# Altium schematic sheet Power.SchDoc
size 431 x 279 mm; SheetNumber: 2; SheetTotal: 6
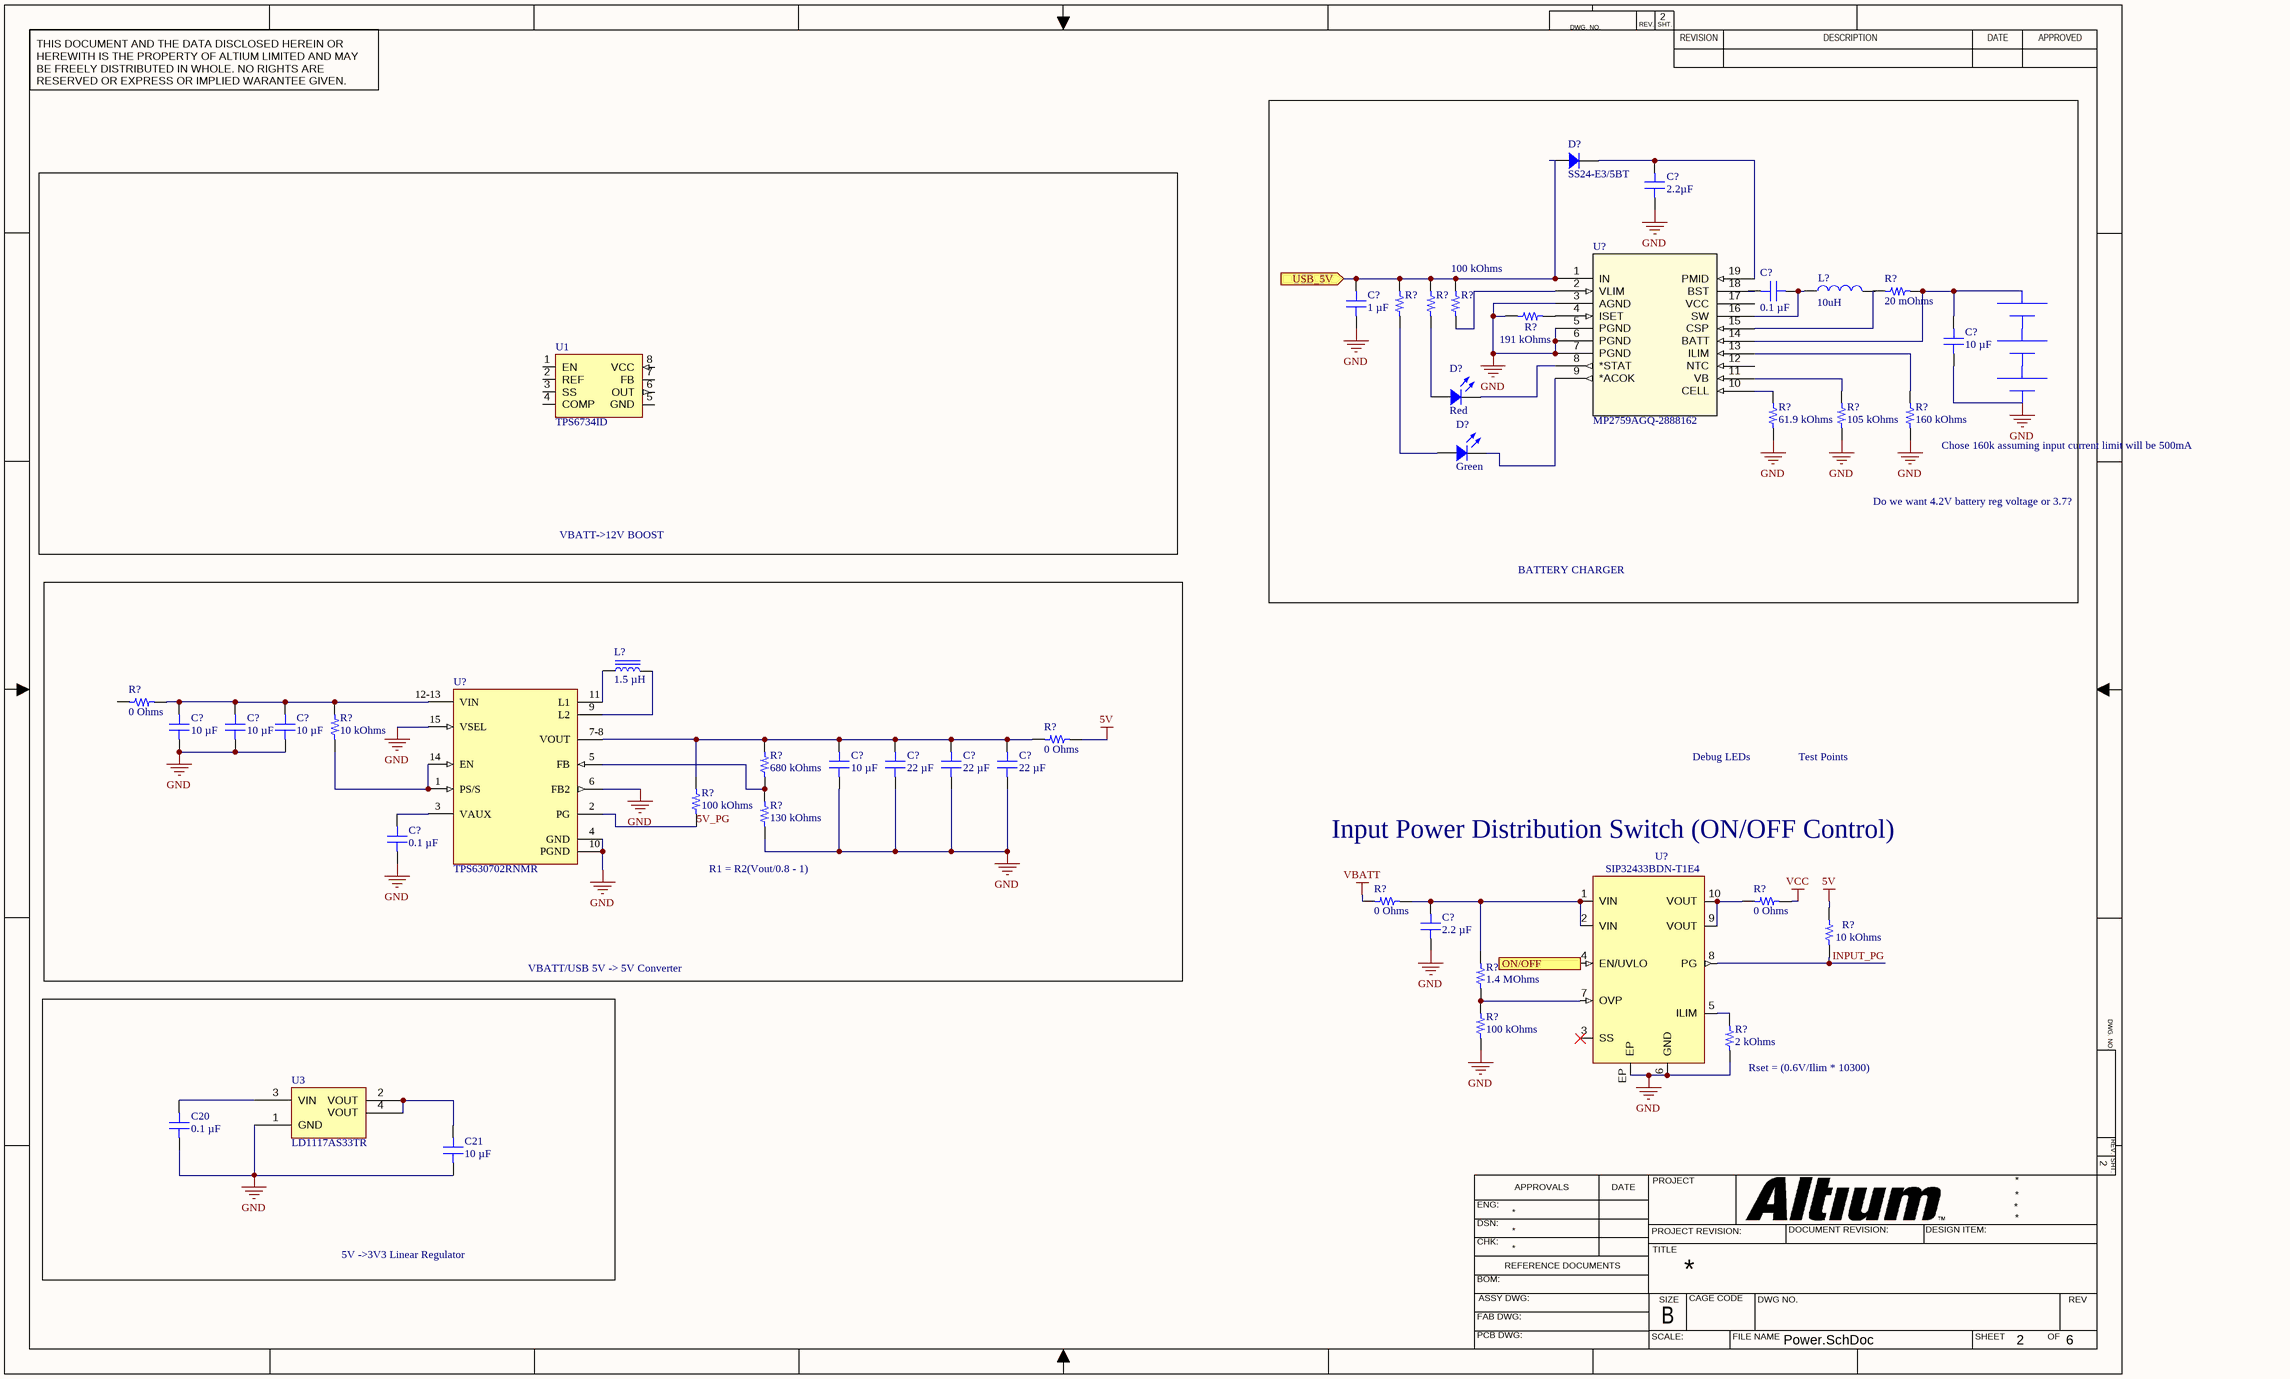
[diagram p0: Power.SchDoc]

## Parts
(Parts that share a designator on the sheet are numbered #1, #2 ... from top to bottom, then left to right.)
*#1  14500 Battery  (value not drawn)  (part A of 3)
*#2  14500 Battery  (value not drawn)  (part A of 3)
*#3  14500 Battery  (value not drawn)  (part A of 3)
C20  0.1 µF  [CAP 0603_1608]
C21  10 µF  [CAP 0603_1608]
C?#1  2.2µF  [CAP 1206_3216 - 1.8MM]
C?#2  0.1 µF  [CAP 0603_1608]
C?#3  1 µF  [CAP 0805_2012]
C?#4  10 µF  [CAP 1206_3216 - 0.8MM]
C?#5  10 µF  [CAP 0603_1608]
C?#6  10 µF  [CAP 0603_1608]
C?#7  10 µF  [CAP 0603_1608]
C?#8  10 µF  [CAP 0603_1608]
C?#9  22 µF  [CAP 0603_1608]
C?#10  22 µF  [CAP 0603_1608]
C?#11  22 µF  [CAP 0603_1608]
C?#12  0.1 µF  [CAP 0603_1608]
C?#13  2.2 µF  [CAP 0805_2012]
D?#1  SS24-E3/5BT  [DO214AA SMB]
D?#2  Red  [LED 1206_3216 RED]
D?#3  Green  [LED 0603_1608 GREEN]
L?#1  10uH  [INDM8366X28N]
L?#2  1.5 µH  [WURTH WE-LQS 6045]
R?#1  20 mOhms  [RES 0805_2012]
R?#2  150 Ohms  [RES 0603_1608]  (value not drawn)
R?#3  150 Ohms  [RES 0603_1608]  (value not drawn)
R?#4  100 kOhms  [RES 0603_1608]
R?#5  191 kOhms  [RES 0603_1608]
R?#6  61.9 kOhms  [RES 0603_1608]
R?#7  105 kOhms  [RES 0603_1608]
R?#8  160 kOhms  [RES 0603_1608]
R?#9  0 Ohms  [RES 0603_1608]
R?#10  10 kOhms  [RES 0603_1608]
R?#11  0 Ohms  [RES 0603_1608]
R?#12  680 kOhms  [RES 0603_1608]
R?#13  100 kOhms  [RES 0603_1608]
R?#14  130 kOhms  [RES 0603_1608]
R?#15  0 Ohms  [RES 0603_1608]
R?#16  0 Ohms  [RES 0603_1608]
R?#17  10 kOhms  [RES 0603_1608]
R?#18  1.4 MOhms  [RES 0603_1608]
R?#19  100 kOhms  [RES 0603_1608]
R?#20  2 kOhms  [RES 0603_1608]
U1  TPS6734ID  [TI SOIC-8 D]
U3  LD1117AS33TR  [ST SOT-223]
U?#1  MP2759AGQ-2888162  [MP2759AGQ-2888162-Footprint-1]
U?#2  TPS630702RNMR  [FP-RNM0015A-MFG]
U?#3  SIP32433BDN-T1E4  [SON50P300X100_HS-11N]

## Blocks framed on the sheet
VBATT->12V BOOST: U1
5V ->3V3 Linear Regulator: C20 C21 U3

## Ports
ON/OFF (in), USB_5V (in)

## Nets
5V: R?#11.2 R?#17.2
GND: C20.1 C21.1 C?#1.2 C?#3.1 C?#4.1 C?#5.1 C?#6.1 C?#7.1 C?#8.1 C?#9.1 C?#10.1 C?#11.1 C?#12.1 C?#13.1 R?#5.1 R?#6.1 R?#7.2 R?#8.1 R?#14.1 R?#19.1 R?#20.1 U3.1(GND) U?#1.3(AGND) U?#1.5(PGND) U?#1.6(PGND) U?#1.7(PGND) U?#2.4(GND) U?#2.6(FB2) U?#2.10(PGND) U?#2.15(VSEL) U?#3.6(GND) U?#3.EP
VBATT: R?#15.1
VCC: R?#16.2
5V_PG: R?#13.1 U?#2.2(PG)
INPUT_PG: R?#17.1 U?#3.8(PG)
ON/OFF: U?#3.4(EN/UVLO) ; port ON/OFF
USB_5V: C?#3.2 D?#1.1 R?#2.2 R?#3.2 R?#4.2 U?#1.1(IN) ; port USB_5V
NetC20_2: C20.2 U3.3(VIN)
NetC21_2: C21.2 U3.2(VOUT) U3.4(VOUT)
NetC?#1_1: C?#1.1 D?#1.2 U?#1.19(PMID)
NetC?#2_1: C?#2.1 U?#1.18(BST)
NetC?#2_2: C?#2.2 L?#1.1 U?#1.16(SW)
NetC?#4_2: C?#4.2 R?#1.2 U?#1.14(BATT)
NetC?#5_2: C?#5.2 C?#6.2 C?#7.2 R?#9.2 R?#10.2 U?#2.12-13(VIN)
NetC?#8_2: C?#8.2 C?#9.2 C?#10.2 C?#11.2 R?#11.1 R?#12.2 R?#13.2 U?#2.7-8(VOUT)
NetC?#12_2: C?#12.2 U?#2.3(VAUX)
NetC?#13_2: C?#13.2 R?#15.2 R?#18.2 U?#3.1(VIN) U?#3.2(VIN)
NetD?#2_1: D?#2.1 R?#3.1
NetD?#2_2: D?#2.2 U?#1.8(*STAT)
NetD?#3_1: D?#3.1 R?#2.1
NetD?#3_2: D?#3.2 U?#1.9(*ACOK)
NetL?#2_1: L?#2.1 U?#2.11(L1)
NetL?#2_2: L?#2.2 U?#2.9(L2)
NetR?#1_1: R?#1.1 U?#1.15(CSP)
NetR?#4_1: R?#4.1 U?#1.2(VLIM)
NetR?#5_2: R?#5.2 U?#1.4(ISET)
NetR?#6_2: R?#6.2 U?#1.10(CELL)
NetR?#7_1: R?#7.1 U?#1.11(VB)
NetR?#8_2: R?#8.2 U?#1.13(ILIM)
NetR?#10_1: R?#10.1 U?#2.1(PS/S) U?#2.14(EN)
NetR?#12_1: R?#12.1 R?#14.2 U?#2.5(FB)
NetR?#16_1: R?#16.1 U?#3.9(VOUT) U?#3.10(VOUT)
NetR?#18_1: R?#18.1 R?#19.2 U?#3.7(OVP)
NetR?#20_2: R?#20.2 U?#3.5(ILIM)

Not connected (* = marked no-connect by the designer): L?#1 2; R?#9 1; U1 1(EN) 2(REF) 3(SS) 4(COMP) 5(GND) 6(OUT) 7(FB) 8(VCC); U?#1 12(NTC) 17(VCC); U?#3 3(SS)*

## Notes on the sheet
- Chose 160k assuming input current limit will be 500mA
- Do we want 4.2V battery reg voltage or 3.7?
- BATTERY CHARGER
- Debug LEDs
- Test Points
- (near R?#14) R1 = R2(Vout/0.8 - 1)
- Input Power Distribution Switch (ON/OFF Control)
- VBATT/USB 5V -> 5V Converter
- (near R?#20) Rset = (0.6V/Ilim * 10300)
- DWG. NO.
- REV.
- SHT.
- THIS DOCUMENT AND THE DATA DISCLOSED HEREIN OR HEREWITH IS THE PROPERTY OF ALTIUM LIMITED AND MAY BE FREELY DISTRIBUTED IN WHOLE. NO RIGHTS ARE RESERVED OR EXPRESS OR IMPLIED WARANTEE GIVEN.
- REVISION
- DESCRIPTION
- DATE
- APPROVED
- ENG:
- APPROVALS
- PROJECT
- DSN:
- CHK:
- REFERENCE DOCUMENTS
- PROJECT REVISION:
- TITLE
- DOCUMENT REVISION:
- DESIGN ITEM:
- BOM:
- FAB DWG:
- PCB DWG:
- ASSY DWG:
- SCALE:
- SIZE
- B
- CAGE CODE
- FILE NAME
- DWG NO.
- SHEET
- OF
- REV

## Library data of the parts
*#1-*#3 = CMP-00063-1: YDL 14500 1000mAh 10A Battery
C20 C?#12 = C0603C104K5RAC7411: CAP CER 0.1UF 50V X7R 0603; manufacturer: KEMET; Tolerance: ±10%; Part Number: C0603C104K5RAC7411; Value: 0.1 µF; Applications: Bypass, Decoupling; Capacitance: 0.1 µF; componentlink1description: Datasheet; componentlink1url: https://api.kemet.com/component-edge/download/datasheet/C0603C104K5RAC7411.pdf; componentlink2description: DigiKey Link; componentlink2url: https://www.digikey.com/en/products/detail/kemet/C0603C104K5RAC7411/3317013; Device Package: 0603 (1608 Metric); Lifecycle Status: Active; Mounting Type: Surface Mount, MLCC; Operating Temperature: -55°C ~ 125°C; Package / Case: 0603 (1608 Metric); packaging: TapeAndReel; partid: 2233; Part Status: Active; price: 0.01; series: SMD Comm X7R; Size / Dimension: 0.063" L x 0.031" W (1.60mm x 0.80mm); Supplier 1: DigiKey; Temperature Coefficient: X7R; Thickness (Max): 0.035" (0.90mm); Voltage - Rated: 50V
  C20: lastupdated: 2022-03-07 3:18:24 PM; Minimum Order: 15000; Supplier Part Number 1: 399-7374-2-ND
  C?#12: lastupdated: 2023-01-26 8:08:16 PM; Minimum Order: 1; Supplier Part Number 1: 399-C0603C104K5RAC7411CT-ND
C21 = GRT188R61C106ME13D: CAP CER 10UF 16V X5R 0603; manufacturer: Murata Electronics; Tolerance: ±20%; Part Number: GRT188R61C106ME13D; Value: 10 µF; Applications: Automotive; Capacitance: 10 µF; componentlink1description: Datasheet; componentlink1url: https://search.murata.co.jp/Ceramy/image/img/A01X/G101/ENG/GRT188R61C106ME13-01.pdf; componentlink2description: DigiKey Link; componentlink2url: https://www.digikey.com/en/products/detail/murata-electronics/GRT188R61C106ME13D/5416740; Device Package: 0603 (1608 Metric); lastupdated: 2022-03-07 3:18:24 PM; Lifecycle Status: Active; Minimum Order: 1; Mounting Type: Surface Mount, MLCC; Operating Temperature: -55°C ~ 85°C; Package / Case: 0603 (1608 Metric); packaging: TapeAndReel; partid: 2515; Part Status: Active; price: 0.07; Ratings: AEC-Q200; series: GRT; Size / Dimension: 0.063" L x 0.031" W (1.60mm x 0.80mm); Supplier 1: DigiKey; Supplier Part Number 1: 490-12318-1-ND; Temperature Coefficient: X5R; Thickness (Max): 0.035" (0.90mm); Voltage - Rated: 16V
C?#1 = 12065C225K4Z2A: CAP CER 2.2UF 50V X7R 1206; manufacturer: AVX Corporation; Tolerance: ±10%; Part Number: 12065C225K4Z2A; Value: 2.2µF; Applications: Automotive, Boardflex Sensitive; Capacitance: 2.2µF; componentlink1description: Datasheet; componentlink1url: http://datasheets.avx.com/FlexitermMLCC.pdf; componentlink2description: DigiKey Link; componentlink2url: http://digikey.com/product-detail/en/avx-corporation/12065C225K4Z2A/478-9559-1-ND/5322897; Device Package: 1206 (3216 Metric); Features: Soft Termination; lastupdated: 2020-09-02 1:05:40 AM; Lifecycle Status: Active; Minimum Order: 1; Mounting Type: Surface Mount, MLCC; Operating Temperature: -55°C ~ 125°C; Package / Case: 1206 (3216 Metric); packaging: TapeAndReel; partid: 20142; Part Status: Active; price: 0.12; Ratings: AEC-Q200; series: FLEXITERM®; Size / Dimension: 0.126" L x 0.063" W (3.20mm x 1.60mm); Supplier 1: DigiKey; Supplier Part Number 1: 478-9559-1-ND; Temperature Coefficient: X7R; Thickness (Max): 0.070" (1.78mm); Voltage - Rated: 50V
C?#2 = CS0603KRX7R7BB104: CAP CER 0.1UF 16V X7R 0603; manufacturer: Yageo; Tolerance: ±10%; Part Number: CS0603KRX7R7BB104; Value: 0.1 µF; Applications: Boardflex Sensitive; Capacitance: 0.1 µF; componentlink1description: Datasheet; componentlink1url: http://www.yageo.com/NewPortal/yageodocoutput?fileName=/pdf/MLCC/UPY-ST_NPOX7R_16V-to-3KV_5.pdf; componentlink2description: DigiKey Link; componentlink2url: https://www.digikey.com/en/products/detail/yageo/CS0603KRX7R7BB104/6097897; Device Package: 0603 (1608 Metric); Features: Soft Termination; lastupdated: 2023-01-29 8:08:26 PM; Lifecycle Status: Active; Minimum Order: 1; Mounting Type: Surface Mount, MLCC; Operating Temperature: -55°C ~ 125°C; Package / Case: 0603 (1608 Metric); packaging: TapeAndReel; partid: 2286; Part Status: Active; price: 0.01; series: CS; Size / Dimension: 0.063" L x 0.031" W (1.60mm x 0.80mm); Supplier 1: DigiKey; Supplier Part Number 1: 311-3560-1-ND; Temperature Coefficient: X7R; Thickness (Max): 0.037" (0.95mm); Voltage - Rated: 16V
C?#3 = GCJ21BR71H105KA01L: CAP CER 1UF 50V X7R 0805; manufacturer: Murata Electronics; Tolerance: ±10%; Part Number: GCJ21BR71H105KA01L; Value: 1 µF; Applications: Automotive, Boardflex Sensitive; Capacitance: 1 µF; componentlink1description: Datasheet; componentlink1url: https://www.murata.com/~/media/webrenewal/support/library/catalog/products/capacitor/mlcc/c03e.ashx?la=en-us; componentlink2description: DigiKey Link; componentlink2url: https://www.digikey.com/en/products/detail/murata-electronics/GCJ21BR71H105KA01L/4903512; Device Package: 0805 (2012 Metric); Features: Soft Termination; lastupdated: 2023-01-26 8:11:38 PM; Lifecycle Status: Active; Minimum Order: 1; Mounting Type: Surface Mount, MLCC; Operating Temperature: -55°C ~ 125°C; Package / Case: 0805 (2012 Metric); packaging: TapeAndReel; partid: 2709; Part Status: Active; price: 0.05; Ratings: AEC-Q200; series: GCJ; Size / Dimension: 0.079" L x 0.049" W (2.00mm x 1.25mm); Supplier 1: DigiKey; Supplier Part Number 1: 490-10667-1-ND; Temperature Coefficient: X7R; Thickness (Max): 0.057" (1.45mm); Voltage - Rated: 50V
C?#4 = CL31B106KBHNNNE: CAP CER 10UF 50V X7R 1206; manufacturer: Samsung Electro-Mechanics; Tolerance: ±10%; Part Number: CL31B106KBHNNNE; Value: 10 µF; Applications: General Purpose; Capacitance: 10 µF; componentlink1description: Datasheet; componentlink1url: http://www.samsungsem.com/kr/support/product-search/mlcc/CL31B106KBHNNNE.jsp; componentlink2description: DigiKey Link; componentlink2url: https://www.digikey.com/en/products/detail/samsung-electro-mechanics/CL31B106KBHNNNE/5961251; Device Package: 1206 (3216 Metric); lastupdated: 2023-01-31 8:13:35 PM; Lifecycle Status: Active; Minimum Order: 1; Mounting Type: Surface Mount, MLCC; Operating Temperature: -55°C ~ 125°C; Package / Case: 1206 (3216 Metric); packaging: TapeAndReel; partid: 40563; Part Status: Active; price: 0.06; series: CL; Size / Dimension: 0.126" L x 0.063" W (3.20mm x 1.60mm); Supplier 1: DigiKey; Supplier Part Number 1: 1276-6767-1-ND; Temperature Coefficient: X7R; Thickness (Max): 0.071" (1.80mm); Voltage - Rated: 50V
C?#5-C?#8 = GRM188R61E106MA73J: CAP CER 10UF 25V X5R 0603; manufacturer: Murata Electronics; Tolerance: ±20%; Part Number: GRM188R61E106MA73J; Value: 10 µF; Applications: General Purpose; Capacitance: 10 µF; componentlink1description: Datasheet; componentlink1url: https://search.murata.co.jp/Ceramy/image/img/A01X/G101/ENG/GRM188R61E106MA73-01.pdf; componentlink2description: DigiKey Link; componentlink2url: https://www.digikey.com/en/products/detail/murata-electronics/GRM188R61E106MA73J/4905347; Device Package: 0603 (1608 Metric); lastupdated: 2023-01-26 8:07:52 PM; Lifecycle Status: Active; Minimum Order: 1; Mounting Type: Surface Mount, MLCC; Operating Temperature: -55°C ~ 85°C; Package / Case: 0603 (1608 Metric); packaging: TapeAndReel; partid: 10710; Part Status: Active; price: 0.04; series: GRM; Size / Dimension: 0.063" L x 0.031" W (1.60mm x 0.80mm); Supplier 1: DigiKey; Supplier Part Number 1: 490-12737-1-ND; Temperature Coefficient: X5R; Thickness (Max): 0.039" (1.00mm); Voltage - Rated: 25V
C?#9-C?#11 = CL10A226MPCNUBE: CAP CER 22UF 10V X5R 0603; manufacturer: Samsung Electro-Mechanics; Tolerance: ±20%; Part Number: CL10A226MPCNUBE; Value: 22 µF; Applications: Acoustic Noise Reduction; Capacitance: 22 µF; componentlink1description: Datasheet; componentlink1url: http://www.samsungsem.com/kr/support/product-search/mlcc/CL10A226MPCNUBE.jsp; componentlink2description: DigiKey Link; componentlink2url: https://www.digikey.com/en/products/detail/samsung-electro-mechanics/CL10A226MPCNUBE/5960988; Device Package: 0603 (1608 Metric); lastupdated: 2023-01-26 8:08:11 PM; Lifecycle Status: Active; Minimum Order: 1; Mounting Type: Surface Mount, MLCC; Operating Temperature: -55°C ~ 85°C; Package / Case: 0603 (1608 Metric); packaging: TapeAndReel; partid: 3985; Part Status: Active; price: 0.05; series: CL; Size / Dimension: 0.063" L x 0.031" W (1.60mm x 0.80mm); Supplier 1: DigiKey; Supplier Part Number 1: 1276-6504-1-ND; Temperature Coefficient: X5R; Thickness (Max): 0.037" (0.95mm); Voltage - Rated: 10V
C?#13 = C2012X7R1V225K125AB: CAP CER 2.2UF 35V X7R 0805; manufacturer: TDK Corporation; Tolerance: ±10%; Part Number: C2012X7R1V225K125AB; Value: 2.2 µF; Applications: General Purpose; Capacitance: 2.2 µF; componentlink1description: Datasheet; componentlink1url: https://product.tdk.com/info/en/catalog/datasheets/mlcc_commercial_general_en.pdf?ref_disty=digikey; componentlink2description: DigiKey Link; componentlink2url: https://www.digikey.com/en/products/detail/tdk-corporation/C2012X7R1V225K125AB/2732986; Device Package: 0805 (2012 Metric); Features: Low ESL; lastupdated: 2023-01-03 8:10:54 PM; Lifecycle Status: Active; Minimum Order: 1; Mounting Type: Surface Mount, MLCC; Operating Temperature: -55°C ~ 125°C; Package / Case: 0805 (2012 Metric); packaging: TapeAndReel; partid: 3412; Part Status: Active; price: 0.12; series: C; Size / Dimension: 0.079" L x 0.049" W (2.00mm x 1.25mm); Supplier 1: DigiKey; Supplier Part Number 1: 445-7551-1-ND; Temperature Coefficient: X7R; Thickness (Max): 0.057" (1.45mm); Voltage - Rated: 35V
D?#1 = SS24-E3/5BT: DIODE SCHOTTKY 40V 2A DO214AA; Manufacturer: Vishay Semiconductor Diodes Division; Current - Reverse Leakage @ Vr: 400µA @ 40V; Speed: Fast Recovery =< 500ns, > 200mA (Io); Voltage - Forward (Vf) (Max) @ If: 500mV @ 2A; Part Number: SS24-E3/5BT; ComponentLink1Description: Datasheet; ComponentLink1URL: http://www.vishay.com/docs/88748/ss22.pdf; ComponentLink2Description: DigiKey Link; ComponentLink2URL: http://digikey.com/product-detail/en/vishay-semiconductor-diodes-division/SS24-E3-5BT/SS24-E3-5BTGICT-ND/9601220; Current - Average Rectified (Io): 2A; Diode Type: Schottky; LastUpdated: 2023-01-26 8:45:53 PM; Lifecycle Status: Active; Minimum Order: 1; Mounting Type: Surface Mount; Operating Temperature - Junction: -65°C ~ 125°C; Package / Case: DO-214AA, SMB; Packaging: TapeAndReel; PartId: 1482; Part Status: Active; Price: 0.14; Series: -; Supplier 1: DigiKey; Supplier Part Number 1: SS24-E3/5BTGICT-ND; Supplier Device Package: DO-214AA (SMB); Voltage - DC Reverse (Vr) (Max): 40V
D?#2 = LTST-C150KRKT: LED RED CLEAR 1206 SMD; Manufacturer: Lite-On Inc.; Configuration: Standard; Current - Test: 20mA; Lens Color: Colorless; Lens Size: 2.06mm x 1.60mm; Lens Style: Rectangle with Flat Top; Millicandela Rating: 54mcd; Viewing Angle: 130°; Voltage - Forward (Vf) (Typ): 2V; Wavelength - Dominant: 631nm; Wavelength - Peak: 639nm; Part Number: LTST-C150KRKT; Color: Red; ComponentLink1Description: Datasheet; ComponentLink1URL: http://optoelectronics.liteon.com/upload/download/DS-22-99-0149/LTST-C150KRKT.pdf; ComponentLink2Description: DigiKey Link; ComponentLink2URL: http://digikey.com/product-detail/en/lite-on-inc/LTST-C150KRKT/160-1405-1-ND/386760; Device Package: 1206 (3216 Metric); Height (Max): 1.10mm; LastUpdated: 2023-01-29 8:51:16 PM; Lens Transparency: Clear; Lifecycle Status: Active; Minimum Order: 1; Mounting Type: Surface Mount; Package / Case: 1206 (3216 Metric); Packaging: TapeAndReel; PartId: 218; Part Status: Active; Price: 0.06; Series: -; Size / Dimension: 3.20mm L x 1.60mm W; Supplier 1: DigiKey; Supplier Part Number 1: 160-1405-1-ND; Supplier Device Package: 1206; Value: Red
D?#3 = LTST-C190GKT: LED GREEN CLEAR CHIP SMD; Manufacturer: Lite-On Inc.; Configuration: Standard; Current - Test: 10mA; Lens Color: Colorless; Lens Size: 1.10mm x 0.80mm; Lens Style: Rectangle with Flat Top; Millicandela Rating: 6mcd; Viewing Angle: 130°; Voltage - Forward (Vf) (Typ): 2.1V; Wavelength - Dominant: 569nm; Wavelength - Peak: 565nm; Part Number: LTST-C190GKT; Color: Green; ComponentLink1Description: Datasheet; ComponentLink1URL: //media.digikey.com/pdf/Data%20Sheets/Lite-On%20PDFs/LTST-C190GKT.pdf; ComponentLink2Description: DigiKey Link; ComponentLink2URL: http://digikey.com/product-detail/en/lite-on-inc/LTST-C190GKT/160-1183-1-ND/269255; Device Package: 0603 (1608 Metric); Height (Max): 0.90mm; LastUpdated: 2023-01-26 8:49:52 PM; Lens Transparency: Clear; Lifecycle Status: Active; Minimum Order: 1; Mounting Type: Surface Mount; Package / Case: 0603 (1608 Metric); Packaging: TapeAndReel; PartId: 656; Part Status: Active; Price: 0.04; Series: -; Size / Dimension: 1.60mm L x 0.80mm W; Supplier 1: DigiKey; Supplier Part Number 1: 160-1183-1-ND; Supplier Device Package: Chip LED; Value: Green
L?#1 = CMP-00067-1: 0603 INDUCTOR 10UH 4.5A; DC Resistance (DCR): 700mR; Core Material: Ceramic; Case/Package: 0603
L?#2 = 74404064015: FIXED IND 1.5UH 4.95A 12MOHM SMD; Manufacturer: Würth Elektronik; Frequency - Self Resonant: 115MHz; Inductance Frequency - Test: 100 kHz; Material - Core: Ferrite; Shielding: Semi-Shielded; Tolerance: ±30%; Type: Drum Core, Wirewound; Part Number: 74404064015; ComponentLink1Description: Datasheet; ComponentLink1URL: https://www.we-online.com/katalog/datasheet/74404064015.pdf; ComponentLink2Description: DigiKey Link; ComponentLink2URL: https://www.digikey.com/en/products/detail/würth-elektronik/74404064015/4865687; Current Rating (Amps): 4.95 A; DC Resistance (DCR): 12mOhm; Height - Seated (Max): 0.177" (4.50mm); Inductance: 1.5 µH; LastUpdated: 2023-01-26 9:05:08 PM; Lifecycle Status: Active; Minimum Order: 1; Mounting Type: Surface Mount; Operating Temperature: -40°C ~ 125°C; Packaging: TapeAndReel; PartId: 5565; Part Status: Active; Price: 0.74; Ratings: AEC-Q200; Series: WE-LQS; Size / Dimension: 0.236" L x 0.236" W (6.00mm x 6.00mm); Supplier 1: DigiKey; Supplier Part Number 1: 732-5542-1-ND; Supplier Device Package: 6045; Value: 1.5 µH
R?#1 = RL0805FR-7W0R02L: RES 0.02 OHM 1% 1/4W 0805; Manufacturer: Yageo; Power (Watts): 0.25W, 1/4W; Temperature Coefficient: ±1200ppm/°C; Part Number: RL0805FR-7W0R02L; Value: 20 mOhms; ComponentLink1Description: Datasheet; ComponentLink1URL: http://www.yageo.com/documents/recent/PYu-RL_Group_521_RoHS_L_2.pdf; ComponentLink2Description: DigiKey Link; ComponentLink2URL: https://www.digikey.com/en/products/detail/yageo/RL0805FR-7W0R02L/3885401; Composition: Thick Film; Device Package: 0805 (2012 Metric); Features: Automotive AEC-Q200, Current Sense, Moisture Resistant; Height - Seated (Max): 0.024" (0.60mm); LastUpdated: 2023-01-02 8:44:46 PM; Lifecycle Status: Active; Minimum Order: 1; Number of Terminations: 2; Operating Temperature: -55°C ~ 125°C; Package / Case: 0805 (2012 Metric); Packaging: TapeAndReel; PartId: 29289; Part Status: Active; Price: 0.19; Ratings: AEC-Q200; Resistance: 20 mOhms; Series: RL; Size / Dimension: 0.079" L x 0.049" W (2.00mm x 1.25mm); Supplier 1: DigiKey; Supplier Part Number 1: 311-.02LUCT-ND; Supplier Device Package: 0805; Tolerance: ±1%
R?#2 R?#3 = RT0603BRD07150RL: RES SMD 150 OHM 0.1% 1/10W 0603; Manufacturer: Yageo; Power (Watts): 0.1W, 1/10W; Temperature Coefficient: ±25ppm/°C; Part Number: RT0603BRD07150RL; Value: 150 Ohms; ComponentLink1Description: Datasheet; ComponentLink1URL: https://www.yageo.com/upload/media/product/productsearch/datasheet/rchip/PYu-RT_1-to-0.01_RoHS_L_11.pdf; ComponentLink2Description: DigiKey Link; ComponentLink2URL: https://www.digikey.com/en/products/detail/yageo/RT0603BRD07150RL/1072258; Composition: Thin Film; Device Package: 0603 (1608 Metric); Height - Seated (Max): 0.022" (0.55mm); LastUpdated: 2023-01-24 9:53:56 PM; Lifecycle Status: Active; Minimum Order: 1; Number of Terminations: 2; Operating Temperature: -55°C ~ 155°C; Package / Case: 0603 (1608 Metric); Packaging: TapeAndReel; PartId: 17042; Part Status: Active; Price: 0.04; Resistance: 150 Ohms; Series: RT; Size / Dimension: 0.063" L x 0.031" W (1.60mm x 0.80mm); Supplier 1: DigiKey; Supplier Part Number 1: YAG1533CT-ND; Supplier Device Package: 0603; Tolerance: ±0.1%
R?#4 = RNCS0603BKE100K: RES 100K OHM 0.1% 1/16W 0603; Manufacturer: Stackpole Electronics Inc; Power (Watts): 0.063W, 1/16W; Temperature Coefficient: ±25ppm/°C; Part Number: RNCS0603BKE100K; Value: 100 kOhms; ComponentLink1Description: Datasheet; ComponentLink1URL: https://www.seielect.com/catalog/sei-rncs_rnch.pdf; ComponentLink2Description: DigiKey Link; ComponentLink2URL: https://www.digikey.com/en/products/detail/stackpole-electronics-inc/RNCS0603BKE100K/1708835; Composition: Thin Film; Device Package: 0603 (1608 Metric); Features: Anti-Corrosive, Automotive AEC-Q200, Moisture Resistant; Height - Seated (Max): 0.022" (0.55mm); LastUpdated: 2023-01-24 9:54:36 PM; Lifecycle Status: Active; Minimum Order: 1; Number of Terminations: 2; Operating Temperature: -55°C ~ 155°C; Package / Case: 0603 (1608 Metric); Packaging: TapeAndReel; PartId: 4849; Part Status: Active; Price: 0.08; Ratings: AEC-Q200; Resistance: 100 kOhms; Series: RNCS; Size / Dimension: 0.061" L x 0.031" W (1.55mm x 0.80mm); Supplier 1: DigiKey; Supplier Part Number 1: RNCS0603BKE100KCT-ND; Supplier Device Package: 0603; Tolerance: ±0.1%
R?#5 = RC0603FR-07191KL: RES 191K OHM 1% 1/10W 0603; Manufacturer: Yageo; Power (Watts): 0.1W, 1/10W; Temperature Coefficient: ±100ppm/°C; Part Number: RC0603FR-07191KL; Value: 191 kOhms; ComponentLink1Description: Datasheet; ComponentLink1URL: https://www.yageo.com/upload/media/product/productsearch/datasheet/rchip/PYu-RC_Group_51_RoHS_L_10.pdf; ComponentLink2Description: DigiKey Link; ComponentLink2URL: https://www.digikey.com/en/products/detail/yageo/RC0603FR-07191KL/727005; Composition: Thick Film; Device Package: 0603 (1608 Metric); Features: Moisture Resistant; Height - Seated (Max): 0.022" (0.55mm); LastUpdated: 2023-01-24 9:54:27 PM; Lifecycle Status: Active; Minimum Order: 1; Number of Terminations: 2; Operating Temperature: -55°C ~ 155°C; Package / Case: 0603 (1608 Metric); Packaging: CutTape; PartId: 7764; Part Status: Active; Price: 0.01; Resistance: 191 kOhms; Series: RC_L; Size / Dimension: 0.063" L x 0.031" W (1.60mm x 0.80mm); Supplier 1: DigiKey; Supplier Part Number 1: 311-191KHRCT-ND; Supplier Device Package: 0603; Tolerance: ±1%
R?#6 = MCT06030C6192FP500: RES SMD 61.9K OHM 1% 1/8W 0603; Manufacturer: Vishay Beyschlag; Power (Watts): 0.125W, 1/8W; Temperature Coefficient: ±50ppm/°C; Part Number: MCT06030C6192FP500; Value: 61.9 kOhms; ComponentLink1Description: Datasheet; ComponentLink1URL: http://www.vishay.com/docs/28705/mcx0x0xpro.pdf; ComponentLink2Description: DigiKey Link; ComponentLink2URL: http://digikey.com/product-detail/en/vishay-beyschlag/MCT06030C6192FP500/749-MCT06030C6192FP500CT-ND/10453899; Composition: Thin Film; Device Package: 0603 (1608 Metric); Features: Anti-Sulfur; Height - Seated (Max): 0.022" (0.55mm); LastUpdated: 2023-01-24 9:54:29 PM; Lifecycle Status: Active; Minimum Order: 1; Number of Terminations: 2; Operating Temperature: -55°C ~ 155°C; Package / Case: 0603 (1608 Metric); Packaging: TapeAndReel; PartId: 7080; Part Status: Active; Price: 0.02; Resistance: 61.9 kOhms; Series: MCT - Professional; Size / Dimension: 0.061" L x 0.033" W (1.55mm x 0.85mm); Supplier 1: DigiKey; Supplier Part Number 1: 749-MCT06030C6192FP500CT-ND; Supplier Device Package: 0603; Tolerance: ±1%
R?#7 = RC0603FR-07105KL: RES 105K OHM 1% 1/10W 0603; Manufacturer: Yageo; Power (Watts): 0.1W, 1/10W; Temperature Coefficient: ±100ppm/°C; Part Number: RC0603FR-07105KL; Value: 105 kOhms; ComponentLink1Description: Datasheet; ComponentLink1URL: https://www.yageo.com/upload/media/product/productsearch/datasheet/rchip/PYu-RC_Group_51_RoHS_L_10.pdf; ComponentLink2Description: DigiKey Link; ComponentLink2URL: https://www.digikey.com/en/products/detail/yageo/RC0603FR-07105KL/726893; Composition: Thick Film; Device Package: 0603 (1608 Metric); Features: Moisture Resistant; Height - Seated (Max): 0.022" (0.55mm); LastUpdated: 2023-01-24 9:54:28 PM; Lifecycle Status: Active; Minimum Order: 1; Number of Terminations: 2; Operating Temperature: -55°C ~ 155°C; Package / Case: 0603 (1608 Metric); Packaging: CutTape; PartId: 7511; Part Status: Active; Price: 0.01; Resistance: 105 kOhms; Series: RC_L; Size / Dimension: 0.063" L x 0.031" W (1.60mm x 0.80mm); Supplier 1: DigiKey; Supplier Part Number 1: 311-105KHRCT-ND; Supplier Device Package: 0603; Tolerance: ±1%
R?#8 = RMCF0603FG160K: RES 160K OHM 1% 1/10W 0603; Manufacturer: Stackpole Electronics Inc; Power (Watts): 0.1W, 1/10W; Temperature Coefficient: ±100ppm/°C; Part Number: RMCF0603FG160K; Value: 160 kOhms; ComponentLink1Description: Datasheet; ComponentLink1URL: https://www.seielect.com/catalog/sei-rmcf_rmcp.pdf; ComponentLink2Description: DigiKey Link; ComponentLink2URL: https://www.digikey.com/en/products/detail/stackpole-electronics-inc/RMCF0603FG160K/1713653; Composition: Thick Film; Device Package: 0603 (1608 Metric); Features: Automotive AEC-Q200; Height - Seated (Max): 0.022" (0.55mm); LastUpdated: 2023-01-24 9:54:21 PM; Lifecycle Status: Active; Minimum Order: 1; Number of Terminations: 2; Operating Temperature: -55°C ~ 155°C; Package / Case: 0603 (1608 Metric); Packaging: CutTape; PartId: 9704; Part Status: Active; Price: 0.01; Ratings: AEC-Q200; Resistance: 160 kOhms; Series: RMCF; Size / Dimension: 0.061" L x 0.031" W (1.55mm x 0.80mm); Supplier 1: DigiKey; Supplier Part Number 1: 738-RMCF0603FG160KCT-ND; Supplier Device Package: 0603; Tolerance: ±1%
R?#9 R?#11 R?#15 R?#16 = TLRZ1JTTD: RES 0 OHM JUMPER 0603; Manufacturer: KOA Speer Electronics, Inc.; Part Number: TLRZ1JTTD; Value: 0 Ohms; ComponentLink1Description: Datasheet; ComponentLink1URL: http://www.koaspeer.com/catimages/Products/TLRZ/TLRZ.pdf; ComponentLink2Description: DigiKey Link; ComponentLink2URL: https://www.digikey.com/en/products/detail/koa-speer-electronics-inc/TLRZ1JTTD/9845493; Composition: Metal Element; Device Package: 0603 (1608 Metric); Features: Automotive AEC-Q200, Current Sense; Height - Seated (Max): 0.022" (0.55mm); LastUpdated: 2022-09-19 1:22:34 PM; Lifecycle Status: Active; Minimum Order: 1; Number of Terminations: 2; Operating Temperature: -55°C ~ 170°C; Package / Case: 0603 (1608 Metric); Packaging: TapeAndReel; PartId: 4851; Part Status: Active; Price: 0.08; Ratings: AEC-Q200; Resistance: 0 Ohms; Series: TLRZ; Size / Dimension: 0.063" L x 0.031" W (1.60mm x 0.80mm); Supplier 1: DigiKey; Supplier Part Number 1: 2019-TLRZ1JTTDCT-ND; Supplier Device Package: 0603; Tolerance: Jumper
R?#10 R?#17 = RT0603FRE0710KL: RES SMD 10K OHM 1% 1/10W 0603; Manufacturer: Yageo; Power (Watts): 0.1W, 1/10W; Temperature Coefficient: ±50ppm/°C; Part Number: RT0603FRE0710KL; Value: 10 kOhms; ComponentLink1Description: Datasheet; ComponentLink1URL: https://www.yageo.com/upload/media/product/productsearch/datasheet/rchip/PYu-RT_1-to-0.01_RoHS_L_11.pdf; ComponentLink2Description: DigiKey Link; Composition: Thin Film; Device Package: 0603 (1608 Metric); Height - Seated (Max): 0.022" (0.55mm); Lifecycle Status: Active; Minimum Order: 1; Number of Terminations: 2; Operating Temperature: -55°C ~ 155°C; Package / Case: 0603 (1608 Metric); Packaging: TapeAndReel; PartId: 5671; Part Status: Active; Price: 0.01; Resistance: 10 kOhms; Series: RT; Size / Dimension: 0.063" L x 0.031" W (1.60mm x 0.80mm); Supplier 1: DigiKey; Supplier Part Number 1: YAG2321CT-ND; Supplier Device Package: 0603; Tolerance: ±1%
  R?#10: ComponentLink2URL: https://www.digikey.com/en/products/detail/yageo/RT0603FRE0710KL/1075040; LastUpdated: 2023-01-24 9:54:33 PM
  R?#17: ComponentLink2URL: http://digikey.com/product-detail/en/yageo/RT0603FRE0710KL/YAG2321CT-ND/5252435; LastUpdated: 2022-03-07 3:35:56 PM
R?#12 = CRGP0603F680K: RES 680K OHM 1% 1/4W 0603; Manufacturer: TE Connectivity Passive Product; Power (Watts): 0.25W, 1/4W; Temperature Coefficient: ±100ppm/°C; Part Number: CRGP0603F680K; Value: 680 kOhms; ComponentLink1Description: Datasheet; ComponentLink1URL: https://www.te.com/commerce/DocumentDelivery/DDEController?Action=srchrtrv&DocNm=9-1773463-9&DocType=DS&DocLang=English; ComponentLink2Description: DigiKey Link; ComponentLink2URL: https://www.digikey.com/en/products/detail/te-connectivity-passive-product/CRGP0603F680K/8577052; Composition: Thick Film; Device Package: 0603 (1608 Metric); Features: Pulse Withstanding; Height - Seated (Max): 0.022" (0.55mm); LastUpdated: 2023-01-24 9:54:35 PM; Lifecycle Status: Active; Minimum Order: 1; Number of Terminations: 2; Operating Temperature: -55°C ~ 155°C; Package / Case: 0603 (1608 Metric); Packaging: TapeAndReel; PartId: 5045; Part Status: Active; Price: 0.01; Resistance: 680 kOhms; Series: CRGP; Size / Dimension: 0.063" L x 0.031" W (1.60mm x 0.80mm); Supplier 1: DigiKey; Supplier Part Number 1: A130450CT-ND; Supplier Device Package: 0603; Tolerance: ±1%
R?#13 = RCS0603100KFKEA: RES SMD 100K OHM 1% 1/4W 0603; Manufacturer: Vishay Dale; Power (Watts): 0.25W, 1/4W; Temperature Coefficient: ±100ppm/°C; Part Number: RCS0603100KFKEA; Value: 100 kOhms; ComponentLink1Description: Datasheet; ComponentLink1URL: http://www.vishay.com/docs/20065/rcse3.pdf; ComponentLink2Description: DigiKey Link; ComponentLink2URL: https://www.digikey.com/en/products/detail/vishay-dale/RCS0603100KFKEA/5866946; Composition: Thick Film; Device Package: 0603 (1608 Metric); Features: Automotive AEC-Q200, Pulse Withstanding; Height - Seated (Max): 0.020" (0.50mm); LastUpdated: 2023-01-24 9:54:34 PM; Lifecycle Status: Active; Minimum Order: 1; Number of Terminations: 2; Operating Temperature: -55°C ~ 155°C; Package / Case: 0603 (1608 Metric); Packaging: TapeAndReel; PartId: 5363; Part Status: Active; Price: 0.02; Ratings: AEC-Q200; Resistance: 100 kOhms; Series: RCS e3; Size / Dimension: 0.061" L x 0.033" W (1.55mm x 0.85mm); Supplier 1: DigiKey; Supplier Part Number 1: 541-2800-1-ND; Supplier Device Package: 0603; Tolerance: ±1%
R?#14 = RC0603FR-07130KL: RES 130K OHM 1% 1/10W 0603; Manufacturer: Yageo; Power (Watts): 0.1W, 1/10W; Temperature Coefficient: ±100ppm/°C; Part Number: RC0603FR-07130KL; Value: 130 kOhms; ComponentLink1Description: Datasheet; ComponentLink1URL: https://www.yageo.com/upload/media/product/productsearch/datasheet/rchip/PYu-RC_Group_51_RoHS_L_10.pdf; ComponentLink2Description: DigiKey Link; ComponentLink2URL: https://www.digikey.com/en/products/detail/yageo/RC0603FR-07130KL/726935; Composition: Thick Film; Device Package: 0603 (1608 Metric); Features: Moisture Resistant; Height - Seated (Max): 0.022" (0.55mm); LastUpdated: 2023-01-24 9:54:12 PM; Lifecycle Status: Active; Minimum Order: 1; Number of Terminations: 2; Operating Temperature: -55°C ~ 155°C; Package / Case: 0603 (1608 Metric); Packaging: CutTape; PartId: 12403; Part Status: Active; Price: 0.01; Resistance: 130 kOhms; Series: RC_L; Size / Dimension: 0.063" L x 0.031" W (1.60mm x 0.80mm); Supplier 1: DigiKey; Supplier Part Number 1: 311-130KHRCT-ND; Supplier Device Package: 0603; Tolerance: ±1%
R?#18 = RK73H1JTTD1404F: RES 1.4M OHM 1% 1/10W 0603; Manufacturer: KOA Speer Electronics, Inc.; Power (Watts): 0.1W, 1/10W; Temperature Coefficient: ±200ppm/°C; Part Number: RK73H1JTTD1404F; Value: 1.4 MOhms; ComponentLink1Description: Datasheet; ComponentLink1URL: http://www.koaspeer.com/catimages/Products/RK73H/RK73H.pdf; ComponentLink2Description: DigiKey Link; ComponentLink2URL: https://www.digikey.com/en/products/detail/koa-speer-electronics-inc/RK73H1JTTD1404F/9845444; Composition: Thick Film; Device Package: 0603 (1608 Metric); Features: Automotive AEC-Q200, Moisture Resistant; Height - Seated (Max): 0.022" (0.55mm); LastUpdated: 2023-01-02 8:30:22 PM; Lifecycle Status: Active; Minimum Order: 1; Number of Terminations: 2; Operating Temperature: -55°C ~ 155°C; Package / Case: 0603 (1608 Metric); Packaging: CutTape; PartId: 6117; Part Status: Active; Price: 0.01; Ratings: AEC-Q200; Resistance: 1.4 MOhms; Series: RK73H; Size / Dimension: 0.063" L x 0.031" W (1.60mm x 0.80mm); Supplier 1: DigiKey; Supplier Part Number 1: 2019-RK73H1JTTD1404FCT-ND; Supplier Device Package: 0603; Tolerance: ±1%
R?#19 = RT0603FRE07100KL: RES SMD 100K OHM 1% 1/10W 0603; Manufacturer: Yageo; Power (Watts): 0.1W, 1/10W; Temperature Coefficient: ±50ppm/°C; Part Number: RT0603FRE07100KL; Value: 100 kOhms; ComponentLink1Description: Datasheet; ComponentLink1URL: https://www.yageo.com/upload/media/product/productsearch/datasheet/rchip/PYu-RT_1-to-0.01_RoHS_L_11.pdf; ComponentLink2Description: DigiKey Link; ComponentLink2URL: http://digikey.com/product-detail/en/yageo/RT0603FRE07100KL/YAG2319CT-ND/5252433; Composition: Thin Film; Device Package: 0603 (1608 Metric); Height - Seated (Max): 0.022" (0.55mm); LastUpdated: 2022-03-07 3:35:56 PM; Lifecycle Status: Active; Minimum Order: 1; Number of Terminations: 2; Operating Temperature: -55°C ~ 155°C; Package / Case: 0603 (1608 Metric); Packaging: TapeAndReel; PartId: 5677; Part Status: Active; Price: 0.01; Resistance: 100 kOhms; Series: RT; Size / Dimension: 0.063" L x 0.031" W (1.60mm x 0.80mm); Supplier 1: DigiKey; Supplier Part Number 1: YAG2319CT-ND; Supplier Device Package: 0603; Tolerance: ±1%
R?#20 = RMCF0603FT2K00: RES 2K OHM 1% 1/10W 0603; Manufacturer: Stackpole Electronics Inc; Power (Watts): 0.1W, 1/10W; Temperature Coefficient: ±100ppm/°C; Part Number: RMCF0603FT2K00; Value: 2 kOhms; ComponentLink1Description: Datasheet; ComponentLink1URL: https://www.seielect.com/catalog/sei-rmcf_rmcp.pdf; ComponentLink2Description: DigiKey Link; ComponentLink2URL: https://www.digikey.com/en/products/detail/stackpole-electronics-inc/RMCF0603FT2K00/1761334; Composition: Thick Film; Device Package: 0603 (1608 Metric); Features: Automotive AEC-Q200; Height - Seated (Max): 0.022" (0.55mm); LastUpdated: 2022-09-19 1:22:30 PM; Lifecycle Status: Active; Minimum Order: 1; Number of Terminations: 2; Operating Temperature: -55°C ~ 155°C; Package / Case: 0603 (1608 Metric); Packaging: CutTape; PartId: 6085; Part Status: Active; Price: 0.01; Ratings: AEC-Q200; Resistance: 2 kOhms; Series: RMCF; Size / Dimension: 0.061" L x 0.031" W (1.55mm x 0.80mm); Supplier 1: DigiKey; Supplier Part Number 1: RMCF0603FT2K00CT-ND; Supplier Device Package: 0603; Tolerance: ±1%
U1 = CMP-001-0000-2: Switching Regulator, Current-Mode, 1.5A, 170kHz Switching Freq-Max, CMOS, PDSO8; Min Input Voltage: 2.7V; Efficiency: 86%; Max Output Current: 150mA; Nominal Supply Current: 2.5mA; Max Output Voltage: 12.6V; Output Configuration: Positive; Number of Outputs: 1; Output Voltage: 12.12V; Output Type: Fixed; Topology: Boost; Nominal Output Voltage: 12V; Output Power: 725mW; Synchronous Rectifier: No; Height: 1.58mm; Width: 3.91mm; Length: 4.9mm; RoHS Compliant: Yes; Switching Frequency: 170kHz; Max Operating Temperature: 85°C; Number of Pins: 8; Packaging: Rail/Tube; Radiation Hardening: No; Mount: Surface Mount; Output Current: 150mA; Reach SVHC Compliant: Yes; Min Output Voltage: 12.12V; Weight: 0.002677oz; Min Operating Temperature: -40°C; Package Quantity: 75; Lead Free: Lead Free; Operating Supply Voltage: 12V; Max Input Voltage: 12V; Series: -; Case/Package: SOIC
U3 = LD1117AS33TR: IC REG LINEAR 3.3V 1A SOT223; Manufacturer: STMicroelectronics; Current - Quiescent (Iq): 10 mA; Number of Regulators: 1; Output Configuration: Positive; Output Type: Fixed; Protection Features: Over Current, Over Temperature; PSRR: 75dB (120Hz); Voltage Dropout (Max): 1.3V @ 1A; Voltage - Input (Max): 15V; Part Number: LD1117AS33TR; ComponentLink1Description: Datasheet; ComponentLink1URL: http://www.st.com/content/ccc/resource/technical/document/datasheet/a5/c3/3f/c9/2b/15/40/49/CD00002116.pdf/files/CD00002116.pdf/jcr:content/translations/en.CD00002116.pdf; ComponentLink2Description: DigiKey Link; ComponentLink2URL: https://www.digikey.com/en/products/detail/stmicroelectronics/LD1117AS33TR/585752; Current - Output: 1A; LastUpdated: 2022-09-19 1:59:38 PM; Lifecycle Status: Active; Minimum Order: 1; Mounting Type: Surface Mount; Operating Temperature: 0°C ~ 125°C; Package / Case: TO-261-4, TO-261AA; Packaging: TapeAndReel; Part Status: Active; Price: 0.45; Series: -; Supplier 1: DigiKey; Supplier Part Number 1: 497-1228-1-ND; Supplier Device Package: SOT-223; Voltage - Output (Min/Fixed): 3.3V
U?#1 = CMP-00066-1: Battery Charger Li-Ion/Li-Pol 6 Cell 3A 3.6V/4V/4.1V/4.15V/4.2V/4.35V/4.4V 19-Pin QFN T/R
U?#2 = CMP-04918-000193-1: POWER MANAGEMENT
U?#3 = CMP-00062-1: SIP32433 Series 23 V 78 mOhm 3.5 A High Side Power Switch - DFN-10